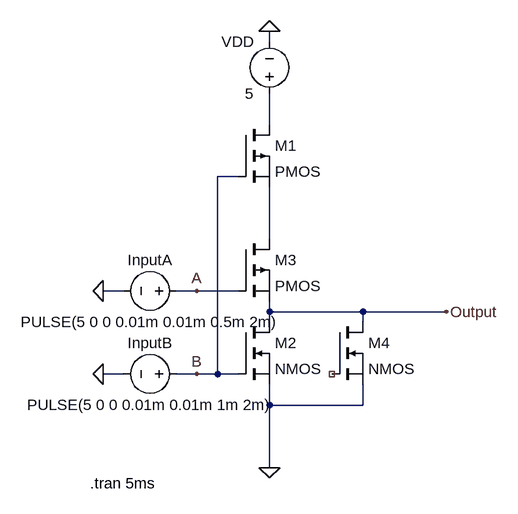
[diagram p0: schematic 3-2.asc]
3-2.asc, the LTspice schematic file:
Version 4
SHEET 1 880 792
WIRE 64 96 64 80
WIRE 64 224 64 176
WIRE 16 304 -16 304
WIRE 64 400 64 320
WIRE -160 480 -192 480
WIRE -48 480 -80 480
WIRE 16 480 -48 480
WIRE 64 512 64 496
WIRE 208 512 64 512
WIRE 336 512 208 512
WIRE 64 528 64 512
WIRE 208 528 208 512
WIRE -160 608 -192 608
WIRE -48 608 -80 608
WIRE -16 608 -16 304
WIRE -16 608 -48 608
WIRE 16 608 -16 608
WIRE 64 656 64 624
WIRE 208 656 208 624
WIRE 208 656 64 656
WIRE 64 752 64 656
FLAG 64 80 0
FLAG 64 752 0
FLAG -192 480 0
FLAG -192 608 0
FLAG 336 512 Output
FLAG -48 480 A
FLAG -48 608 B
SYMBOL voltage 64 192 R180
WINDOW 0 24 96 Left 2
WINDOW 3 24 16 Left 2
WINDOW 123 0 0 Left 0
WINDOW 39 0 0 Left 0
SYMATTR InstName VDD
SYMATTR Value 5
SYMBOL pmos 16 224 R0
SYMATTR InstName M1
SYMBOL pmos 16 400 R0
SYMATTR InstName M3
SYMBOL voltage -64 608 R90
WINDOW 0 -32 56 VBottom 2
WINDOW 3 32 56 VTop 2
WINDOW 123 0 0 Left 0
WINDOW 39 0 0 Left 0
SYMATTR InstName InputB
SYMATTR Value PULSE(5 0 0 0.01m 0.01m 1m 2m)
SYMBOL voltage -64 480 R90
WINDOW 0 -32 56 VBottom 2
WINDOW 3 32 56 VTop 2
WINDOW 123 0 0 Left 0
WINDOW 39 0 0 Left 0
SYMATTR InstName InputA
SYMATTR Value PULSE(5 0 0 0.01m 0.01m 0.5m 2m)
SYMBOL nmos 16 528 R0
SYMATTR InstName M2
SYMBOL nmos 160 528 R0
SYMATTR InstName M4
TEXT -212 776 Left 2 !.tran 5ms

The netlist it stands for:
* 3-2.asc
VDD N001 0 5
M1 N001 B N002 N002 PMOS
M3 N002 A Output Output PMOS
V§InputB B 0 PULSE(5 0 0 0.01m 0.01m 1m 2m)
V§InputA A 0 PULSE(5 0 0 0.01m 0.01m 0.5m 2m)
M2 Output B 0 0 NMOS
M4 Output NC_01 0 0 NMOS
.model NMOS NMOS
.model PMOS PMOS
.lib standard.mos
.tran 5ms
.backanno
.end